# EAGLE design nfc_micro (EAGLE 9.6.2)
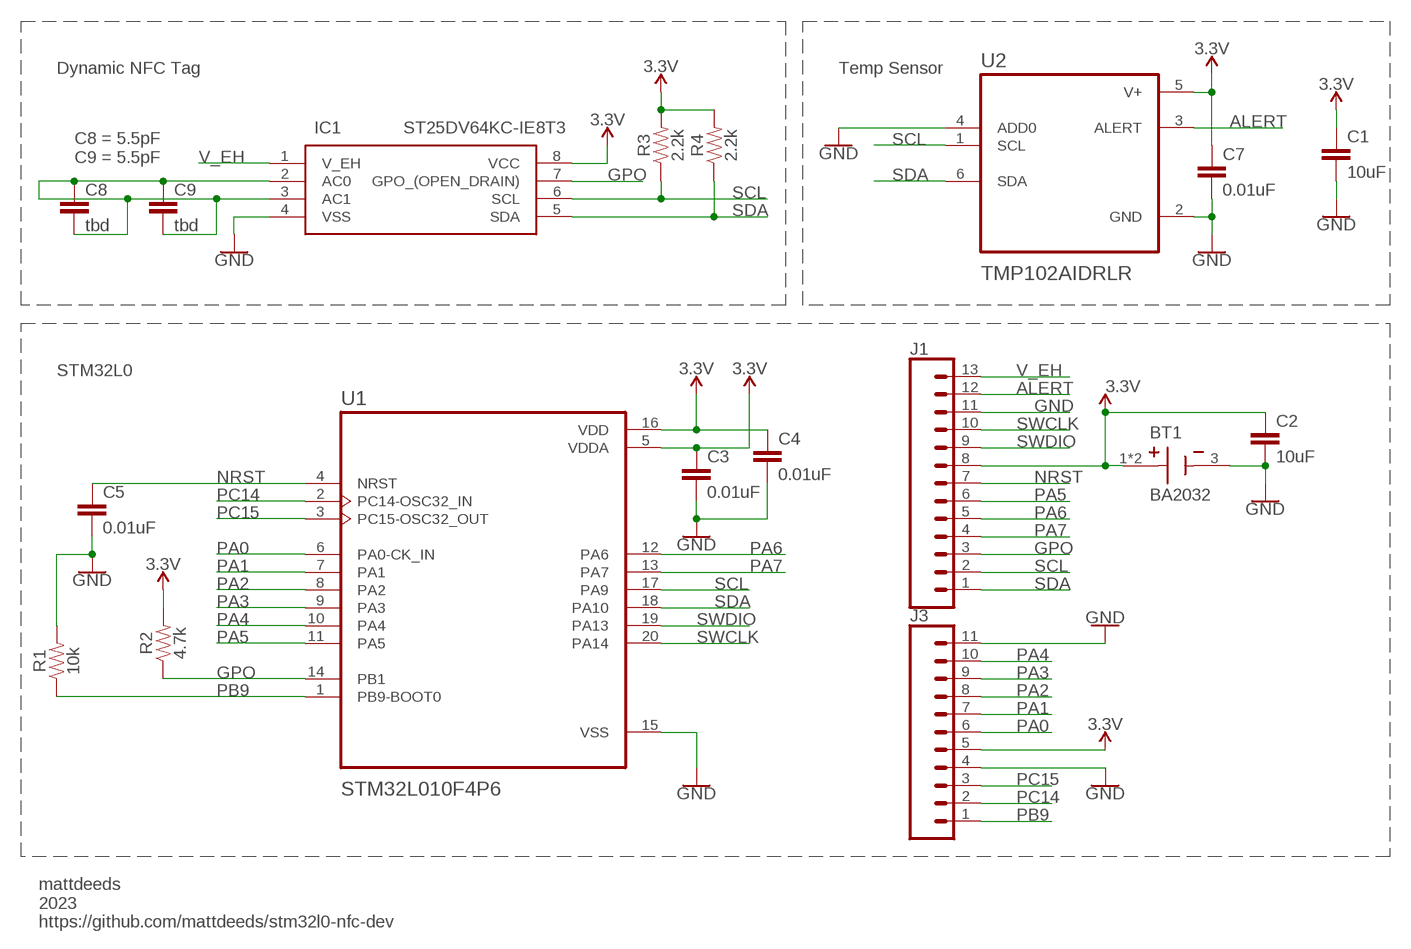
[diagram p0: schematic, sheet 1]

## Parts
BT1  BA2032  [BAT_BA2032]
C1  10uF  10UF-0603-6.3V-20%  [0603]
C2  10uF  10UF-0603-6.3V-20%  [0603]
C3  0.01uF  0.1UF-0603-25V-(+80/-20%)  [0603]
C4  0.01uF  0.1UF-0603-25V-(+80/-20%)  [0603]
C5  0.01uF  0.1UF-0603-25V-(+80/-20%)  [0603]
C7  0.01uF  0.1UF-0603-25V-(+80/-20%)  [0603]
C8  tbd  10UF-0603-6.3V-20%  [0603]
C9  tbd  10UF-0603-6.3V-20%  [0603]
IC1  ST25DV64KC-IE8T3  [SOP65P640X120-8N]
J1  CONN_13  [1X13]
J3  CONN_11  [1X11]
R1  10k  1KOHM-0603-1/10W-1%  [0603]
R2  4.7k  1KOHM-0603-1/10W-1%  [0603]
R3  2.2k  1KOHM-0603-1/10W-1%  [0603]
R4  2.2k  1KOHM-0603-1/10W-1%  [0603]
U1  STM32L010F4P6  [SOP65P640X120-20N]
U2  TMP102AIDRLR  [SOT50P160X60-6N]

## Nets
3.3V: BT1.1(+) BT1.2(+) C1.1 C2.1 C3.1 C4.1 C7.1 IC1.8(VCC) J1.8 J3.5 R2.2 R3.2 R4.2 U1.5(VDDA) U1.16(VDD) U2.5(V+)
ALERT: J1.12 U2.3(ALERT)
GND: BT1.3(-) C1.2 C2.2 C3.2 C4.2 C5.2 C7.2 IC1.4(VSS) J1.11 J3.4 J3.11 R1.2 U1.15(VSS) U2.2(GND) U2.4(ADD0)
GPO: IC1.7(GPO_(OPEN_DRAIN)) J1.3 R2.1 U1.14(PB1)
N$4: C8.1 C8.2 C9.1 C9.2 IC1.2(AC0) IC1.3(AC1)
NRST: C5.1 J1.7 U1.4(NRST)
PA0: J3.6 U1.6(PA0-CK_IN)
PA1: J3.7 U1.7(PA1)
PA2: J3.8 U1.8(PA2)
PA3: J3.9 U1.9(PA3)
PA4: J3.10 U1.10(PA4)
PA5: J1.6 U1.11(PA5)
PA6: J1.5 U1.12(PA6)
PA7: J1.4 U1.13(PA7)
PB9: J3.1 R1.1 U1.1(PB9-BOOT0)
PC14: J3.2 U1.2(PC14-OSC32_IN)
PC15: J3.3 U1.3(PC15-OSC32_OUT)
SCL: IC1.6(SCL) J1.2 R3.1 U1.17(PA9) U2.1(SCL)
SDA: IC1.5(SDA) J1.1 R4.1 U1.18(PA10) U2.6(SDA)
SWCLK: J1.10 U1.20(PA14)
SWDIO: J1.9 U1.19(PA13)
V_EH: IC1.1(V_EH) J1.13

## Notes on the sheet
- Dynamic NFC Tag | Temp Sensor
- C8 = 5.5pF 
  C9 = 5.5pF
- STM32L0
- mattdeeds
  2023
  https://github.com/mattdeeds/stm32l0-nfc-dev

## Library data of the parts
BT1 = BA2032(1):BA2032: BATTERY HOLDER COIN 20MM PC PIN Check availability <https://pricing.snapeda.com/parts/BA2032/MPD%20%28Memory%20Protection%20Devices%29/view-part?ref=eda>; AVAILABILITY: In Stock; DESCRIPTION: Battery Holder (Open) Coin, 20.0mm 1 Cell SMD (SMT) Tab; MF: MPD (Memory Protection Devices); MP: BA2032; PACKAGE: None; PRICE: None; PURCHASE-URL: https://pricing.snapeda.com/search/part/BA2032/?ref=eda
C1 C2 = SparkFun-Capacitors:10UF: 10.0µF ceramic capacitors A capacitor is a passive two-terminal electrical component used to store electrical energy temporarily in an electric field.; PROD_ID: CAP-11015
C3-C5 C7 = SparkFun-Capacitors:0.1UF: 0.1µF ceramic capacitors A capacitor is a passive two-terminal electrical component used to store electrical energy temporarily in an electric field.; PROD_ID: CAP-00810; VALUE: 0.1uF
C8 C9 = SparkFun-Capacitors:10UF: 10.0µF ceramic capacitors A capacitor is a passive two-terminal electrical component used to store electrical energy temporarily in an electric field.; PROD_ID: CAP-11015; VALUE: 10uF
IC1 = SamacSys_Parts:ST25DV64KC-IE8T3: RFID Transponders Dynamic NFC/RFID tag IC with 64-Kbit EEPROM, and fast transfer mode capability Source: Datasheet <https://www.st.com/resource/en/datasheet/st25dv64kc.pdf>; DESCRIPTION: RFID Transponders Dynamic NFC/RFID tag IC with 64-Kbit EEPROM, and fast transfer mode capability; HEIGHT: 1.2mm; MANUFACTURER_NAME: STMicroelectronics; MANUFACTURER_PART_NUMBER: ST25DV64KC-IE8T3; MOUSER_PART_NUMBER: 511-ST25DV64KC-IE8T3; MOUSER_PRICE-STOCK: https://www.mouser.co.uk/ProductDetail/STMicroelectronics/ST25DV64KC-IE8T3?qs=QNEnbhJQKva4ZdUvGL0fuA%3D%3D
J1 = SparkFun-Connectors:CONN_13: Multi connection point. Often used as Generic Header-pin footprint for 0.1 inch spaced/style header connections On any of the 0.1 inch spaced packages, you can populate with these: Break Away Headers - Straight <https://www.sparkfun.com/products/116> (PRT-00116) Break Away Male Headers - Right Angle <https://www.sparkfun.com/products/553> (PRT-00553) Female Headers <https://www.sparkfun.com/products/115> (PRT-00115) Break Away Headers - Machine Pin <https://www.sparkfun.com/products/117> (PRT-00117) Break Away Female Headers - Swiss Machine Pin <https://www.sparkfun.com/products/743> (PRT-00743) For SCREWTERMINALS and SPRING TERMINALS visit here: Screw Terimnals on SparkFun.com <https://www.sparkfun.com/search/results?term=Screw+Terminals> (5mm/3.5mm/2.54mm spacing) This device is also useful as a general connection point to wire up your design to another part of your project. Our various solder wires solder well into these plated through hole pads. Hook-Up Wire - Assortment (Stranded, 22 AWG) <https://www.sparkfun.com/products/11375> (PRT-11375) Hook-Up Wire - Assortment (Solid Core, 22 AWG) <https://www.sparkfun.com/products/11367> (PRT-11367) View the entire wire category on our website here <https://www.sparkfun.com/categories/141> Special notes: Molex polarized connector foot print use with SKU : PRT-08231 with associated crimp pins and housings. 1MM SMD Version SKU: PRT-10208 NOTES ON THE VARIANTS LOCK and LOCK_LONGPADS... This footprint was designed to help hold the alignment of a through-hole component (i.e. 6-pin header) while soldering it into place. You may notice that each hole has been shifted either up or down by 0.005 of an inch from it's more standard position (which is a perfectly straight line). This slight alteration caused the pins (the squares in the middle) to touch the edges of the holes. Because they are alternating, it causes a "brace" to hold the component in place. 0.005 has proven to be the perfect amount of "off-center" position when using our standard breakaway headers. Although looks a little odd when you look at the bare footprint, once you have a header in there, the alteration is very hard to notice. Also,if you push a header all the way into place, it is covered up entirely on the bottom side.
J3 = SparkFun-Connectors:CONN_11: Multi connection point. Often used as Generic Header-pin footprint for 0.1 inch spaced/style header connections On any of the 0.1 inch spaced packages, you can populate with these: Break Away Headers - Straight <https://www.sparkfun.com/products/116> (PRT-00116) Break Away Male Headers - Right Angle <https://www.sparkfun.com/products/553> (PRT-00553) Female Headers <https://www.sparkfun.com/products/115> (PRT-00115) Break Away Headers - Machine Pin <https://www.sparkfun.com/products/117> (PRT-00117) Break Away Female Headers - Swiss Machine Pin <https://www.sparkfun.com/products/743> (PRT-00743) For SCREWTERMINALS and SPRING TERMINALS visit here: Screw Terimnals on SparkFun.com <https://www.sparkfun.com/search/results?term=Screw+Terminals> (5mm/3.5mm/2.54mm spacing) This device is also useful as a general connection point to wire up your design to another part of your project. Our various solder wires solder well into these plated through hole pads. Hook-Up Wire - Assortment (Stranded, 22 AWG) <https://www.sparkfun.com/products/11375> (PRT-11375) Hook-Up Wire - Assortment (Solid Core, 22 AWG) <https://www.sparkfun.com/products/11367> (PRT-11367) View the entire wire category on our website here <https://www.sparkfun.com/categories/141>
R1-R4 = SparkFun-Resistors:1KOHM: 1kΩ resistor A resistor is a passive two-terminal electrical component that implements electrical resistance as a circuit element. Resistors act to reduce current flow, and, at the same time, act to lower voltage levels within circuits. - Wikipedia; PROD_ID: RES-07856; VALUE: 1k
U1 = STM32L010F4P6:STM32L010F4P6: None Check availability <https://pricing.snapeda.com/parts/STM32L010F4P6/STMicroelectronics/view-part?ref=eda>; AVAILABILITY: In Stock; DESCRIPTION: ARM® Cortex®-M0+ STM32L0 Microcontroller IC 32-Bit Single-Core 32MHz 16KB (16K x 8) FLASH 20-TSSOP; MF: STMicroelectronics; MP: STM32L010F4P6; PACKAGE: TSSOP-20 STMicroelectronics; PRICE: None; PURCHASE-URL: https://pricing.snapeda.com/search/part/STM32L010F4P6/?ref=eda
U2 = TMP102AIDRLR:TMP102AIDRLR: Check availability <https://pricing.snapeda.com/parts/TMP102AIDRLR/Texas%20Instruments/view-part?ref=eda>; AVAILABILITY: In Stock; DESCRIPTION: 2C digital temperature sensor, I2C/SMBus in 2.56mm2 package; MF: Texas Instruments; MP: TMP102AIDRLR; PACKAGE: SOT-5X3-6 Texas Instruments; PRICE: None; PURCHASE-URL: https://pricing.snapeda.com/search/part/TMP102AIDRLR/?ref=eda

## Net classes
1 highpower: width 0.305 mm, drill 0.483 mm
2 lowpower: width 0.254 mm, drill 0.483 mm

## Board
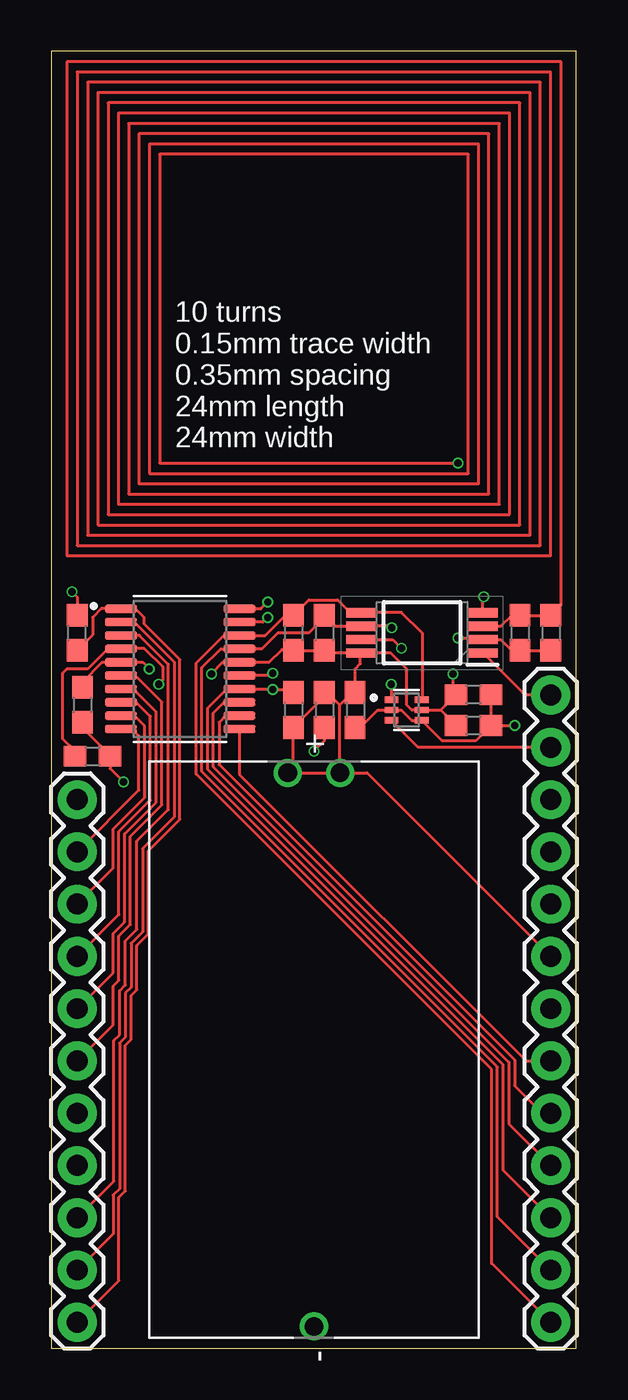
[diagram p1: board, top side]
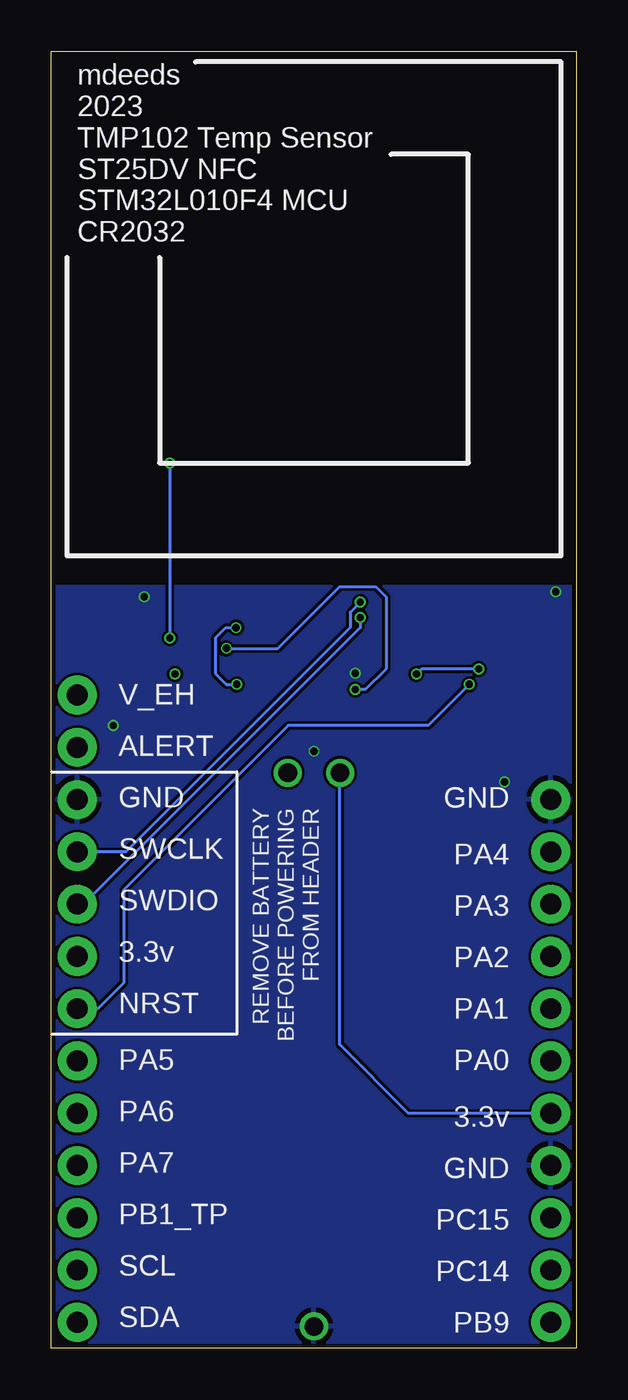
[diagram p2: board, bottom side, seen from below]

Size 25.5 x 63 mm. Coordinates in mm from the lower left corner, seen from the top.
Outline: 0,0 25.5,0 25.5,63 0,63 0,0
Copper layers (1*16): Top 0.035559375mm / dielectric 1.6mm / Bottom 0.035559375mm
Design rules "jlcpcb2layer": minimum track width 5mil, minimum drill 12mil, track to track 5mil, track to pad 5mil, pad to pad 5mil, via to via 5mil, smd to smd 5mil, copper to edge 8mil, drill to drill 6mil, minimum pad ring 5mil, minimum via ring 3mil, stop-mask expansion 2.5mil, vias tented up to drill 0mil, thermal gap 10mil

### Footprints (pad centres in the part's own frame; a part is rotated, then mirrored left to right if it is on the bottom)
BAT_BA2032 = drill 0.91: 1 -13.45,1.27; 2 -13.45,-1.27; 3 13.45,0
0603 = smd 1.1 x 1: 1 -0.85,0; 2 0.85,0
SOP65P640X120-8N = smd 1.475 x 0.45: 1 -2.938,0.975; 2 -2.938,0.325; 3 -2.938,-0.325; 4 -2.938,-0.975; 5 2.938,-0.975; 6 2.938,-0.325; 7 2.938,0.325; 8 2.938,0.975
1X13 = drill 1.016 pad 1.88: 1 0,0; 2 2.54,0; 3 5.08,0; 4 7.62,0; 5 10.16,0; 6 12.7,0; 7 15.24,0; 8 17.78,0; 9 20.32,0; 10 22.86,0; 11 25.4,0; 12 27.94,0; 13 30.48,0
1X11 = drill 1.016 pad 1.88: 1 0,0; 2 2.54,0; 3 5.08,0; 4 7.62,0; 5 10.16,0; 6 12.7,0; 7 15.24,0; 8 17.78,0; 9 20.32,0; 10 22.86,0; 11 25.4,0
SOP65P640X120-20N = smd 1.56 x 0.41: 1 -2.88,2.925; 2 -2.88,2.275; 3 -2.88,1.625; 4 -2.88,0.975; 5 -2.88,0.325; 6 -2.88,-0.325; 7 -2.88,-0.975; 8 -2.88,-1.625; 9 -2.88,-2.275; 10 -2.88,-2.925; 11 2.88,-2.925; 12 2.88,-2.275; 13 2.88,-1.625; 14 2.88,-0.975; 15 2.88,-0.325; 16 2.88,0.325; 17 2.88,0.975; 18 2.88,1.625; 19 2.88,2.275; 20 2.88,2.925
SOT50P160X60-6N = smd 0.66 x 0.31: 1 -0.735,0.5; 2 -0.735,0; 3 -0.735,-0.5; 4 0.735,-0.5; 5 0.735,0; 6 0.735,0.5

### Placement (x,y rotation side)
BT1  12.75,14.5 270 top
C1  20.5,30.25 0 top
C2  14.75,31 270 top
C3  13.25,31 270 top
C4  1.5,31.25 270 top
C5  2,28.75 0 top
C7  20.5,31.75 0 top
C8  22.75,34.75 270 top
C9  24.25,34.75 270 top
IC1  18,34.75 180 top
J1  24.25,1.25 90 top
J3  1.25,1.25 90 top
R1  1.25,34.75 90 top
R2  11.75,31 270 top
R3  13.25,34.75 270 top
R4  11.75,34.75 270 top
U1  6.25,33 0 top
U2  17.25,31 0 top

### Tracks (layer width: path | path; a pad name or v marks a point on that pad's centre or on a via)
3.3V  (via drill 0.35)
  Top 0.152: 15,33.77 IC1.8 16.48,33.77 17.25,33 17.25,31.25 17.5,31 U2.5 18.9,31 | 15,33.77 13.38,33.77 R3.2 R4.2 11.7,33.95 11.2,33.95 10.57,33.33 U1.16 8.32,33.33 7.77,32.77 v7.77,32.75 | C1.1 18.9,31 | 18.9,31 C7.1 19.5,31.9 v19.5,32.75 | BT1.1 BT1.2 11.75,28.22 R2.2 13.25,31.65 C3.1 13.4,31.85 14,31.25 | C4.1 1.5,32.35 2.48,33.33 U1.5 4.42,33.33 v4.75,33 | BT1.1 15.33,27.95 J1.8 | BT1.1 14,27.97 14,31.25 | 14,31.25 14.6,31.85 C2.1 14.75,33 15,33.25 15,33.77
  Bottom 0.152: J3.5 8.16,11.41 11.5,14.75 11.5,27.93 BT1.2 | v4.75,33 7.52,33 v7.77,32.75
ALERT
  Top 0.152: J1.12 17.82,29.19 U2.3
GND  (via drill 0.35)
  Top 0.152: 1.5,30.1 C4.2 1.5,30.15 2.85,28.8 C5.2 2.85,28.15 v3.5,27.5 | v1,36.75 1.25,36.5 R1.2 | C1.2 C7.2 | C1.2 20.6,29.5 18.98,29.5 U2.4 17.5,30.5 17,31 U2.2 15.85,31 15,30.15 C2.2 | IC1.4 20.94,36.44 v21,36.5 | v10.75,32.79 10.64,32.67 U1.15 | C3.2 13.25,29.5 v12.75,29 | C1.2 v22.5,30.25
  pour Bottom: -0.25,37 25.75,37 25.75,-0.5 -0.25,-0.5
GPO  (via drill 0.35)
  Top 0.152: IC1.7 16.57,34.42 v17,34 | R2.1 11.6,32 v10.75,32 10.72,32.02 U1.14 8.53,32.02 7.59,31.09 7.59,28.12 21.94,13.77 21.94,8.64 J1.3
  Bottom 0.152: v17,34 14.5,34 11.5,37 9.75,37 9.25,36.5 9.25,33 10.25,32 v10.75,32
N$4  (via drill 0.35)
  Top 0.15: IC1.3 21.82,35.08 22.35,35.6 C8.1 C9.1 24.75,36.1 24.75,62.5 0.75,62.5 0.75,38.5 24.25,38.5 24.25,62 1.25,62 1.25,39 23.75,39 23.75,61.5 1.75,61.5 1.75,39.5 23.25,39.5 23.25,61 2.25,61 2.25,40 22.75,40 22.75,60.5 2.75,60.5 2.75,40.5 22.25,40.5 22.25,60 3.25,60 3.25,41 21.75,41 21.75,59.5 3.75,59.5 3.75,41.5 21.25,41.5 21.25,59 4.25,59 4.25,42 20.75,42 20.75,58.5 4.75,58.5 4.75,42.5 20.25,42.5 20.25,58 5.25,58 5.25,43 v19.75,43 | v19.75,34.5 20.86,34.5 IC1.2 21.82,34.42 22.35,33.9 C8.2 C9.2
  Bottom 0.15: v19.75,43 v19.75,34.5
NRST  (via drill 0.35)
  Top 0.152: C5.1 1.15,29 0.53,29.62 0.53,32.78 0.75,33 1.75,33 2.75,34 3.35,34 U1.4 3.4,34 4.5,34 5.4,33.1 5.4,32.44 v5.21,32.25
  Bottom 0.152: v5.21,32.25 7.21,30.25 14,30.25 22,22.25 22,17.75 23.26,16.49 J1.7
PA0
  Top 0.152: J3.6 3,15.7 3,17.59 3.28,17.87 3.28,20.02 3.84,20.58 3.84,24.87 5.37,26.4 5.37,31.38 4,32.75 3.44,32.75 U1.6
PA1
  Top 0.152: J3.7 3,18.24 3,20.14 3.56,20.69 3.56,24.98 5.09,26.51 5.09,30.91 3.97,32.02 U1.7
PA2
  Top 0.152: J3.8 3.28,21.06 3.28,25.1 4.81,26.63 4.81,30.69 4.12,31.38 U1.8
PA3
  Top 0.152: J3.9 3,23.32 3,25.21 4.53,26.74 4.53,30.22 4,30.75 3.4,30.75 U1.9
PA4
  Top 0.152: J3.10 4.25,27.11 4.25,29.75 3.92,30.07 U1.10
PA5
  Top 0.152: U1.11 9.13,27.87 23.05,13.95 J1.6
PA6
  Top 0.152: U1.12 9.11,30.75 8.5,30.75 8.15,30.4 8.15,28.35 22.5,14 22.5,12.75 23.84,11.41 J1.5
PA7
  Top 0.152: U1.13 9.01,31.5 8.5,31.5 7.87,30.87 7.87,28.24 22.22,13.88 22.22,10.9 J1.4
PB9
  Top 0.152: R1.1 2,34.65 2,35.5 2.42,35.92 U1.1 4.08,35.92 4.5,35.5 4.5,35.19 6.24,33.45 6.24,25.68 4.71,24.16 4.71,20.11 4.15,19.56 4.15,17.41 3.87,17.13 3.87,14.99 3.59,14.71 3.59,7.63 3.28,7.32 3.28,3.28 J3.1
PC14
  Top 0.152: U1.2 4.01,35.27 5.96,33.33 5.96,25.8 4.43,24.27 4.43,20.23 3.87,19.67 3.87,17.53 3.59,17.25 3.59,15.1 3.31,14.82 3.31,7.74 3,7.43 3,5.54 J3.2
PC15
  Top 0.152: J3.3 3.03,8.11 3.03,14.94 3.31,15.22 3.31,17.36 3.59,17.64 3.59,19.79 4.15,20.35 4.15,24.64 5.68,26.17 5.68,33.22 4.27,34.62 U1.3
SCL  (via drill 0.35)
  Top 0.152: v16.53,35 16.46,35.08 IC1.6 13.78,35.08 R3.1 13.25,35.5 12.5,34.75 11,34.75 10.22,33.98 U1.17 8.22,33.98 7.31,33.06 7.31,28.01 21.66,13.65 21.66,6.38 J1.2 | v16.5,32.25 16.52,32.23 U2.1
  Bottom 0.152: v16.53,35 17.03,35 17.53,34.5 17.53,32.78 17,32.25 v16.5,32.25
SDA
  Top 0.152: U2.6 18,31.52 18,34.75 17,35.75 15.09,35.75 IC1.5 14.53,35.73 13.9,36.35 12.5,36.35 R4.1 11.35,35.6 10.38,34.62 U1.18 8.38,34.62 7.03,33.28 7.03,27.89 21.38,13.54 21.38,4.12 J1.1
SWCLK  (via drill 0.35)
  Top 0.152: U1.20 10.18,35.92 v10.5,36.25
  Bottom 0.152: v10.5,36.25 11,35.75 11,35 21.89,24.11 J1.10
SWDIO  (via drill 0.35)
  Top 0.152: v10.5,35.5 10.28,35.27 U1.19
  Bottom 0.152: v10.5,35.5 10.5,35 23.93,21.57 J1.9
V_EH
  Top 0.152: J1.13 23.02,31.73 20.98,33.77 IC1.1

### Text on the board
tPlace: 10 turns / 0.15mm trace width / 0.35mm spacing / 24mm length / 24mm width
bPlace: mdeeds / 2023 / TMP102 Temp Sensor / ST25DV NFC / STM32L010F4 MCU / CR2032 | V_EH | ALERT | GND | REMOVE BATTERY / BEFORE POWERING / FROM HEADER | GND | PA4 | SWCLK | PA3 | SWDIO | PA2 | 3.3v | PA1 | NRST | PA0 | PA5 | 3.3v | PA6 | GND | PA7 | PC15 | PB1_TP | PC14 | SCL | PB9 | SDA